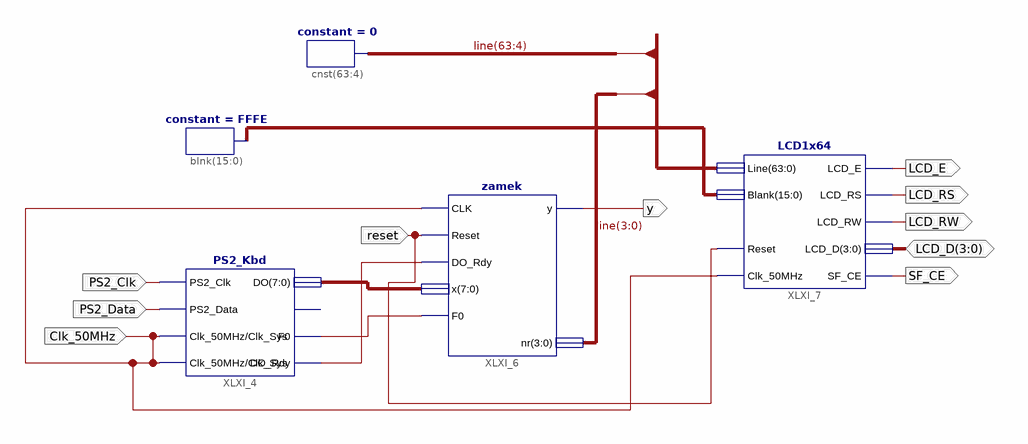
[diagram p0: schematic sheet 1]
// Xilinx ISE schematic zad_1.sch (spartan3e) as structural Verilog: 5 symbols, 10 ports
module zad_1 (
  input  PS2_Clk,
  input  Clk_50MHz,
  input  PS2_Data,
  input  reset,
  inout  [3:0] LCD_D,
  output y,
  output LCD_E,
  output LCD_RS,
  output LCD_RW,
  output SF_CE
);

  wire XLXN_7, XLXN_8;
  wire [7:0] XLXN_1;
  wire [15:0] XLXN_17;
  wire [63:0] line;

  PS2_Kbd XLXI_4 (
    .PS2_Clk(PS2_Clk), .PS2_Data(PS2_Data), .Clk_50MHz(Clk_50MHz), .F0(XLXN_7), .DO_Rdy(XLXN_8), .DO(XLXN_1),
    .Clk_Sys(Clk_50MHz));  // open: E0
  zamek XLXI_6 (.CLK(Clk_50MHz), .Reset(reset), .DO_Rdy(XLXN_8), .F0(XLXN_7), .x(XLXN_1), .y(y), .nr(line[3:0]));
  LCD1x64 XLXI_7 (
    .Clk_50MHz(Clk_50MHz), .Reset(reset), .Line(line), .Blank(XLXN_17), .LCD_D(LCD_D), .LCD_E(LCD_E),
    .LCD_RW(LCD_RW), .LCD_RS(LCD_RS), .SF_CE(SF_CE));
  constant #(.CValue("0")) cnst[63:4] (.O(line[63:4]));
  constant #(.CValue("FFFE")) blnk[15:0] (.O(XLXN_17));
endmodule
